# EasyEDA Pro project MSDRv2.eprj, schematic Schematic4
Board Name: Board2; Create Date: 2025-03-29; Page Name: P1; Project Name: MSDRv2; Schematic Name: Schematic4; Update Date: 2025-03-29; Company: EasyEDA.com; Drawn: EasyEDA; Page Size: A4; Part Number: JLCPCB-002; Reviewed: EasyEDA; Version: V0.1
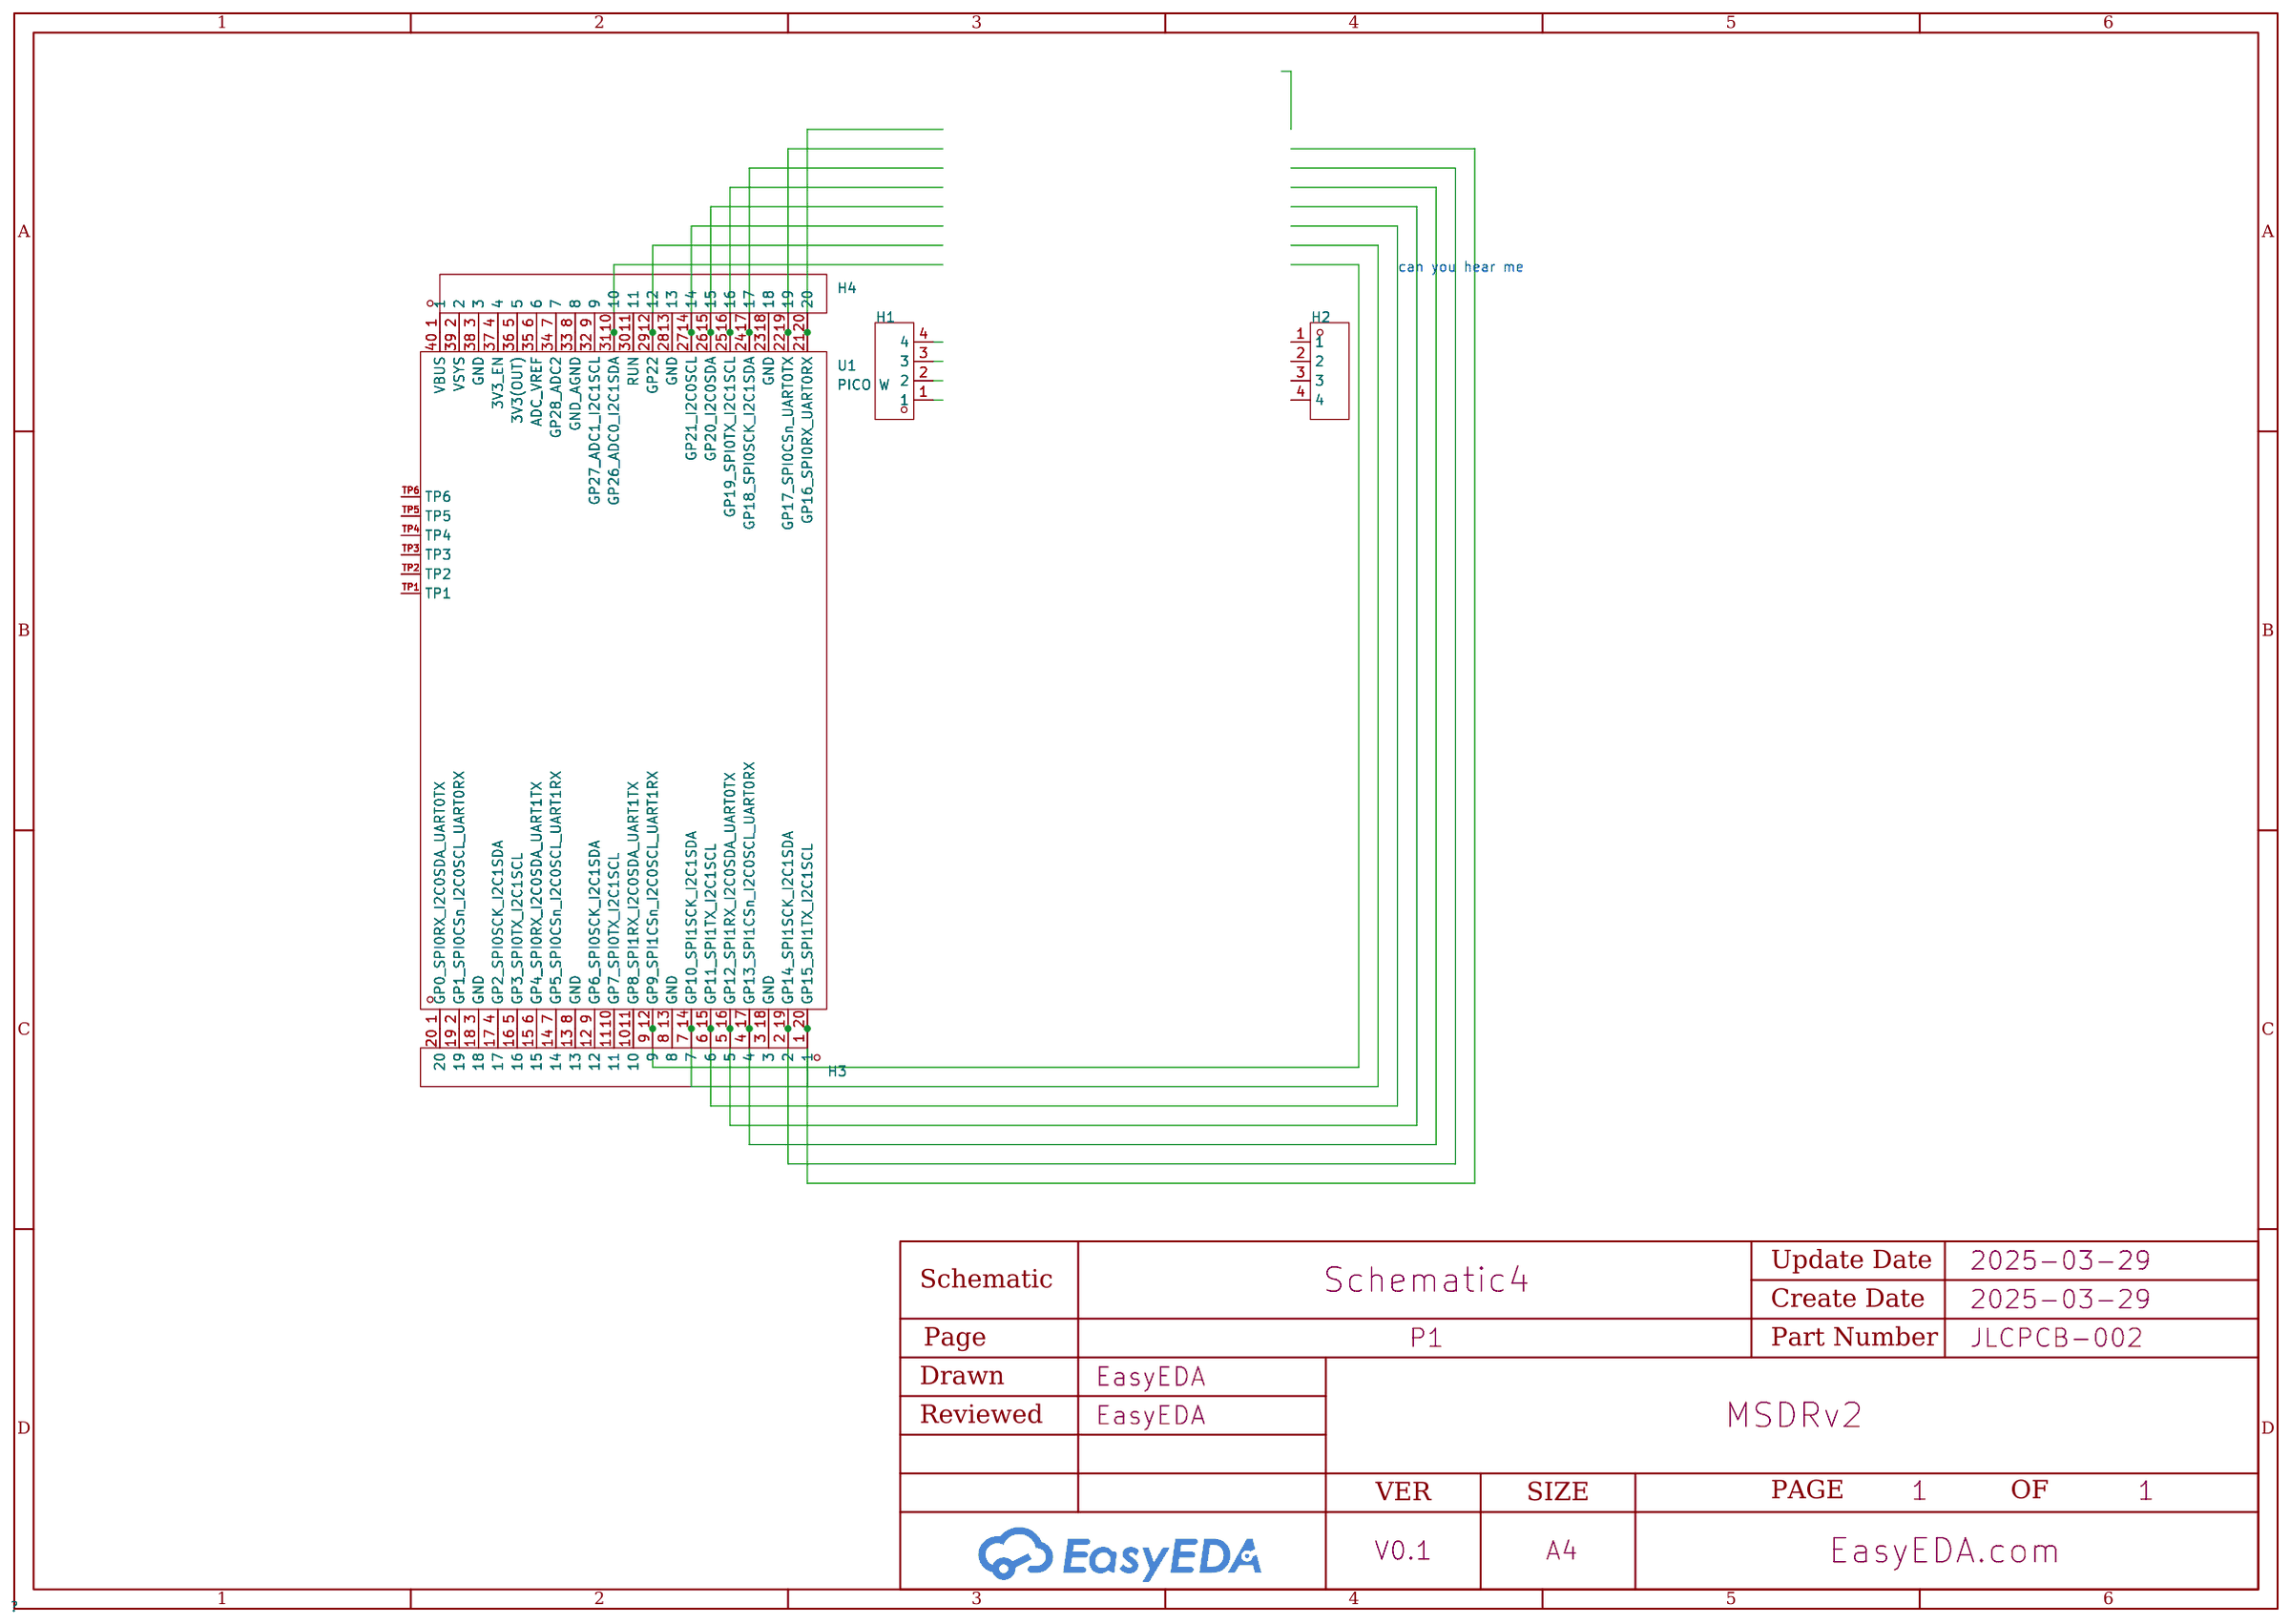
[diagram p6: schematic sheet]

## Parts
CBB1  -
H1  -  [HDR-TH_4P-P2.54-V-M]
H2  -  [HDR-TH_4P-P2.54-V-M]
H3  -  [HDR-TH_20P-P2.54-V-M-1]
H4  -  [HDR-TH_20P-P2.54-V-M-1]
U1  PICO W  [COMM-SMD_L51.0-W21.0-P2.54_PICOW]

## Library data of the parts
H1 H2 = HDR-M_2.54_1x4P: Supplier Footprint: Through
H3 H4 = HDR-M_2.54_1x20P: Supplier Footprint: Through
U1 = PICO W: Supplier Part: C7203003; Manufacturer: Raspberry Pi(树莓派); JLCPCB Part Class: Extended Part; Datasheet: https://atta.szlcsc.com/upload/public/pdf/source/20230906/10B4C0665D815973E97A5F4971CA719F.pdf; Supplier: LCSC

## Nets
$1N2875: H3.20 U1.1(GP0_SPI0RX_I2C0SDA_UART0TX)
$1N2877: H3.19 U1.2(GP1_SPI0CSn_I2C0SCL_UART0RX)
$1N2879: H3.18 U1.3(GND)
$1N2881: H3.17 U1.4(GP2_SPI0SCK_I2C1SDA)
$1N2883: H3.16 U1.5(GP3_SPI0TX_I2C1SCL)
$1N2885: H3.15 U1.6(GP4_SPI0RX_I2C0SDA_UART1TX)
$1N2887: H3.14 U1.7(GP5_SPI0CSn_I2C0SCL_UART1RX)
$1N2889: H3.13 U1.8(GND)
$1N2891: H3.12 U1.9(GP6_SPI0SCK_I2C1SDA)
$1N2893: H3.11 U1.10(GP7_SPI0TX_I2C1SCL)
$1N2895: H3.10 U1.11(GP8_SPI1RX_I2C0SDA_UART1TX)
$1N2897: H3.8 U1.13(GND)
$1N2899: H3.3 U1.18(GND)
$1N2978: H4.18 U1.23(GND)
$1N2980: H4.13 U1.28(GND)
$1N2982: H4.11 U1.30(RUN)
$1N2984: H4.9 U1.32(GP27_ADC1_I2C1SCL)
$1N2986: H4.8 U1.33(GND_AGND)
$1N2988: H4.7 U1.34(GP28_ADC2)
$1N2990: H4.6 U1.35(ADC_VREF)
$1N2992: H4.5 U1.36(3V3(OUT))
$1N2994: H4.4 U1.37(3V3_EN)
$1N2996: H4.3 U1.38(GND)
$1N2998: H4.2 U1.39(VSYS)
$1N3000: H4.1 U1.40(VBUS)
Net-(CBB1-): CBB1.(TXQN) H1.1 H1.2 H1.3 H1.4 H2.1 H2.2 H2.3 H2.4 H3.1 H3.2 H3.4 H3.5 H3.6 H3.7 H3.9 H4.10 H4.12 H4.14 H4.15 H4.16 H4.17 H4.19 H4.20 U1.12(GP9_SPI1CSn_I2C0SCL_UART1RX) U1.14(GP10_SPI1SCK_I2C1SDA) U1.15(GP11_SPI1TX_I2C1SCL) U1.16(GP12_SPI1RX_I2C0SDA_UART0TX) U1.17(GP13_SPI1CSn_I2C0SCL_UART0RX) U1.19(GP14_SPI1SCK_I2C1SDA) U1.20(GP15_SPI1TX_I2C1SCL) U1.21(GP16_SPI0RX_UART0RX) U1.22(GP17_SPI0CSn_UART0TX) U1.24(GP18_SPI0SCK_I2C1SDA) U1.25(GP19_SPI0TX_I2C1SCL) U1.26(GP20_I2C0SDA) U1.27(GP21_I2C0SCL) U1.29(GP22) U1.31(GP26_ADC0_I2C1SDA)

Not connected (* = marked no-connect by the designer): U1 TP1 TP2 TP3 TP4 TP5 TP6

## Notes on the sheet
- can you hear me
